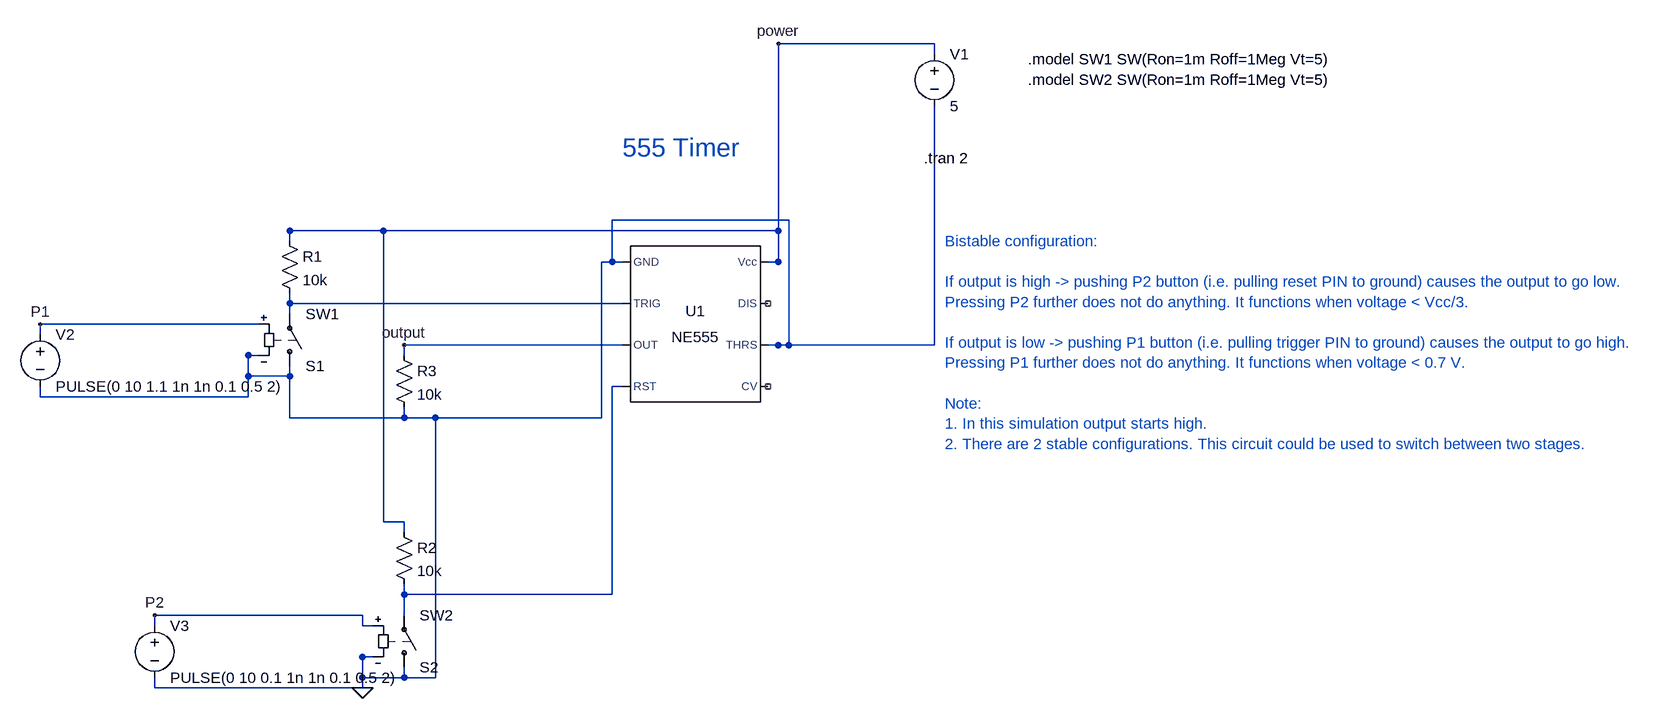
[diagram p0: schematic 555-bistable-mode.asc]
555-bistable-mode.asc, the LTspice schematic file:
Version 4.1
SHEET 1 2012 836
WIRE 48 368 48 384
WIRE -128 304 -128 320
WIRE -176 288 -192 288
WIRE 48 768 48 784
WIRE 0 752 -16 752
WIRE 384 144 368 144
WIRE 608 272 624 272
WIRE 864 -96 864 -80
WIRE -512 336 -512 352
WIRE -336 784 -336 800
WIRE 48 384 -128 384
WIRE -128 384 -128 320
WIRE -128 320 -192 320
WIRE -192 320 -192 288
WIRE -192 288 -192 352
WIRE -192 352 -512 352
WIRE 48 384 96 384
WIRE 96 384 96 784
WIRE 96 784 48 784
WIRE 48 784 -16 784
WIRE -16 784 -16 752
WIRE -16 752 -16 800
WIRE -16 800 -336 800
WIRE 48 384 352 384
WIRE 352 384 352 144
WIRE 352 144 368 144
WIRE 368 144 368 80
WIRE 368 80 640 80
WIRE 640 80 640 272
WIRE 640 272 624 272
WIRE 624 272 864 272
WIRE 864 272 864 -80
FLAG -16 800 0
WIRE -128 192 -128 208
WIRE -128 224 -128 208
WIRE 384 208 368 208
WIRE -128 208 368 208
WIRE 48 640 48 656
WIRE 48 688 48 672
WIRE 384 336 368 336
WIRE 48 656 48 672
WIRE 48 656 368 656
WIRE 368 656 368 336
WIRE -176 240 -192 240
WIRE -512 256 -512 240
WIRE -192 240 -512 240
FLAG -512 240 P1
WIRE 0 704 -16 704
WIRE -336 704 -336 688
WIRE -16 704 -16 688
WIRE -16 688 -336 688
FLAG -336 688 P2
WIRE 48 288 48 272
WIRE 384 272 368 272
WIRE 48 272 368 272
FLAG 48 272 output
WIRE -128 112 -128 96
WIRE 48 560 48 544
WIRE 608 144 624 144
WIRE 864 -176 864 -192
WIRE -128 96 16 96
WIRE 16 96 16 544
WIRE 16 544 48 544
WIRE -128 96 624 96
WIRE 624 96 624 144
WIRE 624 144 624 -192
WIRE 624 -192 864 -192
FLAG 624 -192 power
SYMBOL Misc\\NE555 496 240 R0
SYMATTR InstName U1
SYMBOL res -144 96 R0
SYMATTR InstName R1
SYMATTR Value 10k
SYMBOL voltage 864 -192 R0
WINDOW 123 0 0 Left 2
WINDOW 39 0 0 Left 2
SYMATTR InstName V1
SYMATTR Value 5
SYMBOL sw -128 320 M180
SYMATTR InstName S1
SYMATTR Value SW1
SYMBOL voltage -512 240 R0
WINDOW 123 0 0 Left 0
WINDOW 39 0 0 Left 0
SYMATTR InstName V2
SYMATTR Value PULSE(0 10 1.1 1n 1n 0.1 0.5 2)
SYMBOL res 32 544 R0
SYMATTR InstName R2
SYMATTR Value 10k
SYMBOL sw 48 784 M180
SYMATTR InstName S2
SYMATTR Value SW2
SYMBOL voltage -336 688 R0
WINDOW 123 0 0 Left 0
WINDOW 39 0 0 Left 0
SYMATTR InstName V3
SYMATTR Value PULSE(0 10 0.1 1n 1n 0.1 0.5 2)
SYMBOL res 32 272 R0
SYMATTR InstName R3
SYMATTR Value 10k
TEXT 848 -16 Left 2 !.tran 2
TEXT 384 -32 Left 4 ;555 Timer
TEXT 1008 -168 Left 2 !.model SW1 SW(Ron=1m Roff=1Meg Vt=5)\n.model SW2 SW(Ron=1m Roff=1Meg Vt=5)
TEXT 880 112 Left 2 ;Bistable configuration:\n \nIf output is high -> pushing P2 button (i.e. pulling reset PIN to ground) causes the output to go low.\nPressing P2 further does not do anything. It functions when voltage < Vcc/3.\n \nIf output is low -> pushing P1 button (i.e. pulling trigger PIN to ground) causes the output to go high.\nPressing P1 further does not do anything. It functions when voltage < 0.7 V.\n \nNote:\n1. In this simulation output starts high.\n2. There are 2 stable configurations. This circuit could be used to switch between two stages.

The netlist it stands for:
* 555-bistable-mode.asc
X§U1 0 N001 output N002 NC_01 0 NC_02 power NE555  ; pins GND TRIG OUT RST CV THRS DIS Vcc
R1 power N001 10k
V1 power 0 5
S1 0 N001 P1 0 SW1
V2 P1 0 PULSE(0 10 1.1 1n 1n 0.1 0.5 2)
R2 power N002 10k
S2 0 N002 P2 0 SW2
V3 P2 0 PULSE(0 10 0.1 1n 1n 0.1 0.5 2)
R3 output 0 10k
.tran 2
* 555 Timer
.model SW1 SW(Ron=1m Roff=1Meg Vt=5)
.model SW2 SW(Ron=1m Roff=1Meg Vt=5)
* Bistable configuration:
* If output is high -> pushing P2 button (i.e. pulling reset PIN to ground) causes the output to go low.
* Pressing P2 further does not do anything. It functions when voltage < Vcc/3.
* If output is low -> pushing P1 button (i.e. pulling trigger PIN to ground) causes the output to go high.
* Pressing P1 further does not do anything. It functions when voltage < 0.7 V.
* Note:
* 1. In this simulation output starts high.
* 2. There are 2 stable configurations. This circuit could be used to switch between two stages.
.lib NE555.sub
.backanno
.end